# EAGLE design q1 (EAGLE 9.6.2)
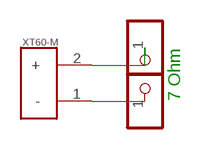
[diagram p0: schematic, sheet 1]

## Parts
J1  XT60-M  [AMASS_XT60-M]
JP1  PINHD-1X1  [1X01]
JP2  PINHD-1X1  [1X01]

## Nets
N$1: J1.2(+) JP1.1
N$2: J1.1(-) JP2.1

## Notes on the sheet
- 7 Ohm

## Library data of the parts
J1 = XT60-M:XT60-M: DC supply; XT60; male; PIN:2; for cable; soldered; 60A; 500V; AVAILABILITY: Unavailable; DESCRIPTION: Plug; DC supply; XT60; male; PIN: 2; for cable; soldered; 30A; 500V; MF: AMASS; MP: XT60-M; PACKAGE: Package; PRICE: None
JP1 JP2 = adafruit:PINHD-1X1: Pin header 1x1 for 0.1" spacing With round pins

## Board
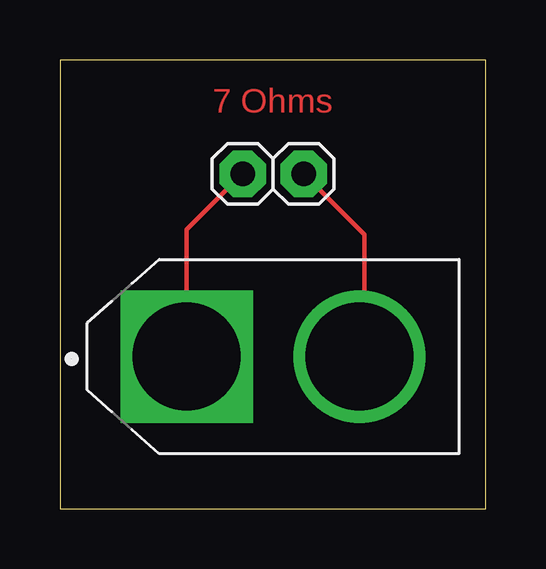
[diagram p1: board, top side]

Size 17.76 x 18.72 mm. Coordinates in mm from the lower left corner, seen from the top.
Outline: 0,0 17.76,0 17.76,18.72 0,18.72 0,0
Copper layers (1*16): Top 0.035mm / dielectric 1.5mm / Bottom 0.035mm
Design rules "default": minimum track width 6mil, minimum drill 0.35mm, track to track 6mil, track to pad 6mil, pad to pad 6mil, via to via 6mil, smd to smd 6mil, copper to edge 40mil, drill to drill 6mil, minimum pad ring 10mil, minimum via ring 8mil, stop-mask expansion 4mil, vias tented up to drill 0mil, thermal gap 10mil

### Footprints (pad centres in the part's own frame; a part is rotated, then mirrored left to right if it is on the bottom)
AMASS_XT60-M = drill 4.5 square: 1 -3.6,0 | drill 4.5: 2 3.6,0
1X01 = drill 1.016 pad 1.93 octagon: 1 0,0

### Placement (x,y rotation side)
J1  8.89,6.35 0 top
JP1  10.16,13.97 0 top
JP2  7.62,13.97 0 top

### Tracks (layer width: path | path; a pad name or v marks a point on that pad's centre or on a via)
N$1
  Top 0.18: J1.2 12.7,6.56 12.7,11.43 JP1.1
N$2
  Top 0.18: J1.1 5.29,11.64 JP2.1

### Text on the board
Top: 7 Ohms